# Altium schematic sheet STEP_DOWN_3V3.SchDoc: =DocumentName
size A4; ENG_APP_DATE: --/--/--; DSN_APP_DATE: --/--/--; CHK_APP_DATE: --/--/--; CompanyName: "AS Manufacturing" LLC; Organization: "AS Manufacturing" LLC; Address1: 5 Sklyarenka St.; Address2: Kyiv 04073; Address3: Ukraine; Address4: https://ajax.systems/en/; SheetNumber: 2; SheetTotal: 5; Template_version: 1.0.1
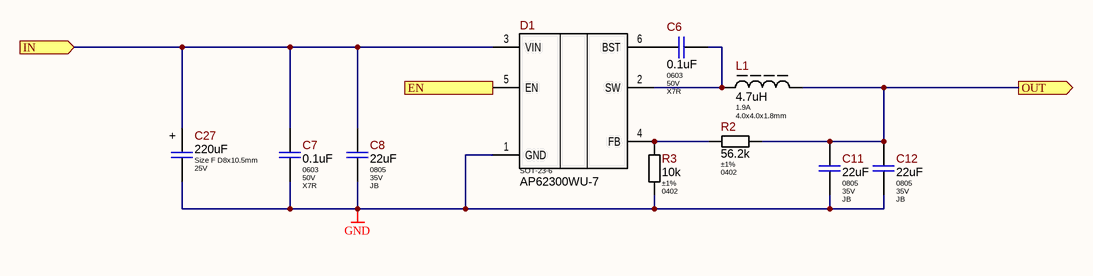
[diagram p0: STEP_DOWN_3V3.SchDoc]

## Parts
C6  Package: 0603  Voltage: 50V  Dielectric Type: X7R  [C_CERAMIC_0603_MED]  (hidden comment: 0.1uF)
C7  Package: 0603  Voltage: 50V  Dielectric Type: X7R  [C_CERAMIC_0603_MED]  (hidden comment: 0.1uF)
C8  Package: 0805  Voltage: 35V  Dielectric Type: JB  [CAP-0805(2012)X125T20]  (hidden comment: 22uF)
C11  Package: 0805  Voltage: 35V  Dielectric Type: JB  [CAP-0805(2012)X125T20]  (hidden comment: 22uF)
C12  Package: 0805  Voltage: 35V  Dielectric Type: JB  [CAP-0805(2012)X125T20]  (hidden comment: 22uF)
C27  value 220uF  Package: Size F D8x10.5mm  Voltage: 25V  [CAP-AE-830x1100H50_MED]  (hidden comment: 220uFx25V)
D1  AP62300WU-7  [SOT-23-6]
L1  Current: 1.9A  Package: 4.0x4.0x1.8mm  [SRN4018-Series_1.8mm]  (hidden comment: 4.7uH)
R2  Tolerance: ±1%  Package: 0402  [R_ANY_CHIP_0402_MED]  (hidden comment: 56.2k)
R3  Tolerance: ±1%  Package: 0402  [R_ANY_CHIP_0402_MED]  (hidden comment: 10k)

## Ports
EN (in), IN (in), OUT (out)

## Nets
GND: C7.1 C8.2 C11.2 C12.2 C27.2 D1.1(GND) R3.2
EN: D1.5(EN) ; port EN
IN: C7.2 C8.1 C27.1 D1.3(VIN) ; port IN
OUT: C11.1 C12.1 L1.2 R2.2 ; port OUT
NetC6_1: C6.1 D1.2(SW) L1.1
NetC6_2: C6.2 D1.6(BST)
NetD1_4: D1.4(FB) R2.1 R3.1

## Notes on the sheet
- Title
- Product:
- Project:
- Size:
- Date:
- Variant:
- A4
- Authors:
- Time:
- Sheet
- of
- Revision:
- @Vitech_ua
- Commit:
- (in symbol MRA-025V221MF105-T/R) +

## Library data of the parts
C6 C7 = CL10B104KB8NNND: 100nF 50V X7R ±10% 0603 Ceramic Capacitor RoHS; Manufacturer: Samsung Electro-Mechanics; Ajax_1C_ID: 21313; Ajax_1C_PN: 100nF 50V X7R 10% 0603 CL10B104KB8NNND ceramic capacitor SMD; Ajax_1С_Status: Substitution; Standard Lead Time: 18 Weeks; Component Status: Released; Replacement: CL10B104KB8NNNC; GUID_1C: f1fd6399-ca68-11ea-ab63-0050569f2651; Value: 0.1uF; Part Number: CL10B104KB8NNND; Part Type: Ceramic / X7R / 0603; Component Type: SMD; Temperature Range: -55°C ~ 125°C; Tolerance: ±10%; ComponentLink1URL: https://media.digikey.com/pdf/Data%20Sheets/Samsung%20PDFs/CL_Series_MLCC_ds.pdf; Supplier 1: Digi-Key; Supplier Part Number 1: CL10B104KB8NNND-ND; Price: 0,0039378; ComponentLink1Description: Datasheet
C8 C11 C12 = C2012JB1V226M125AC: 22uF 35V JB ±20% 0805 Ceramic Capacitor RoHS; Manufacturer: TDK Corporation; Ajax_1C_ID: 32073; Ajax_1C_PN: 22uF 35V 20% 0805 TDK C2012JB1V226M125AC Ceramic Capacitors RoHS; Ajax_1С_Status: RND Only; Standard Lead Time: 30 Weeks; Component Status: Released; Replacement: NONE; GUID_1C: 562d6396-e930-11eb-ab74-0050569f2651; Value: 22uF; Part Number: C2012JB1V226M125AC; Part Type: Ceramic / JB / 0805; Component Type: SMD; Temperature Range: -25°C ~ 85°C; Tolerance: ±20%; ComponentLink1URL: https://product.tdk.com/info/en/catalog/datasheets/mlcc_commercial_general_en.pdf; Supplier 1: Mouser; Supplier Part Number 1: 810-C2012JB1V226M12C; Price: 0,567; ComponentLink1Description: Datasheet
C27 = MRA-025V221MF105-T/R: 220uF 25V ±20% Size F 8x10.5mm SMD Aluminum Electrolytic Capacitor; Manufacturer: Koshin; Ajax_1C_ID: 44442; Ajax_1C_PN: 220uF 25V 20% 8x10.5 MRA-025V221MF105-T/R Koshin Aluminum Electrolytic Capacitor SMD; Ajax_1С_Status: RND Only; Standard Lead Time: NONE; Component Status: Released; GUID_1C: b722054d-ee29-11ec-a915-00505699469b; Part Number: MRA-025V221MF105-T/R; Part Type: Aluminum; Component Type: SMD; Temperature Range: -40°C ~ 105°C; Tolerance: ±20%; Dielectric Type: NONE; ComponentLink1URL: \\altiumdb.ajax.local\files\Datasheet\Capacitor\MRA-25V22 5X5.4,25V220 8X10.5(2022-5-14)Ajax.pdf; Replacement: NONE; Price: 0; ComponentLink1Description: Datasheet
D1 = AP62300WU-7: 4.35V to 18V, 2A, High Efficiency Synchronous Step Down Converter, 500kHz, SOT-23-6; Manufacturer: Diodes Incorporated; Ajax_1С_Status: RND Only; Component Status: Released; Replacement: NONE; Part Type: Power / DC-DC / Buck; Component Type: SMD; Temperature Range: -40°C ~ 85°C; ComponentLink1Description: Datasheet; Package: SOT-23-6; Part Number: AP62300WU-7
L1 = SRN4018-4R7M: 4.7uH Semi-Shielded Wirewound Inductor 1.9A 84mOhm Max; Manufacturer: Bourns Inc; Ajax_1C_ID: 20972; Ajax_1C_PN: 4.7uH SRN4018-4R7M SMD Индуктивность; Ajax_1С_Status: RND Only; Saturation Current: 2A; Tolerance: ±20%; Component Status: Released; Standard Lead Time: 42 Weeks; Replacement: NONE; GUID_1C: 7ba8f5fd-b629-11ea-ab61-0050569f2651; Value: 4.7uH; Part Number: SRN4018-4R7M; Part Type: Power / Ferrite Core; Component Type: SMD; Temperature Range: -25°C ~ 120°C; ComponentLink1URL: https://eu.mouser.com/datasheet/2/54/srn4018-1391320.pdf; Supplier 1: Mouser; Supplier Part Number 1: 652-SRN4018-4R7M; Price: 0,291; ComponentLink1Description: Datasheet
R2 = RC0402FR-0756K2L: 56.2 kOhms ±1% 1/16W 0402 Thick Film Resistor; Manufacturer: Yageo; Ajax_1C_ID: 20241; Ajax_1C_PN: 56.2k 1% 0402 Resistors SMD RoHS; Ajax_1С_Status: Mass Production; Power Rating: 0.062W; Voltage: 50V; Component Status: Released; Temperature Stability: ±100ppm/°C; Replacement: NONE; GUID_1C: 73881b35-8945-11ea-ab60-0050569f2651; Value: 56.2k; Part Number: RC0402FR-0756K2L; Component Type: SMD; Part Type: Thick Film; Temperature Range: -55°C ~ 155°C; ComponentLink1URL: https://eu.mouser.com/datasheet/2/447/PYu_RC_Group_51_RoHS_L_11-1984063.pdf; Supplier 1: Digi-Key; Supplier Part Number 1: YAG3187TR-ND; Price: 0,00065; ComponentLink1Description: Datasheet
R3 = RC0402FR-0710KL: 10 kOhms ±1% 1/16W 0402 Thick Film Resistor; Manufacturer: Yageo; Ajax_1C_ID: 6717; Ajax_1C_PN: 10k 1% 0402 Resistors SMD RoHS; Ajax_1С_Status: Mass Production; Power Rating: 0.062W; Voltage: 50V; Component Status: Released; Temperature Stability: ±100ppm/°C; Replacement: NONE; GUID_1C: 2e173059-2610-11e5-ad28-a45d36c4a9e5; Value: 10k; Part Number: RC0402FR-0710KL; Component Type: SMD; Part Type: Thick Film; Temperature Range: -55°C ~ 155°C; ComponentLink1URL: https://eu.mouser.com/datasheet/2/447/PYu_RC_Group_51_RoHS_L_10-1664068.pdf; Supplier 1: Digi-Key; Supplier Part Number 1: 311-10.0KLRTR-ND; Price: 0,00065; ComponentLink1Description: Datasheet